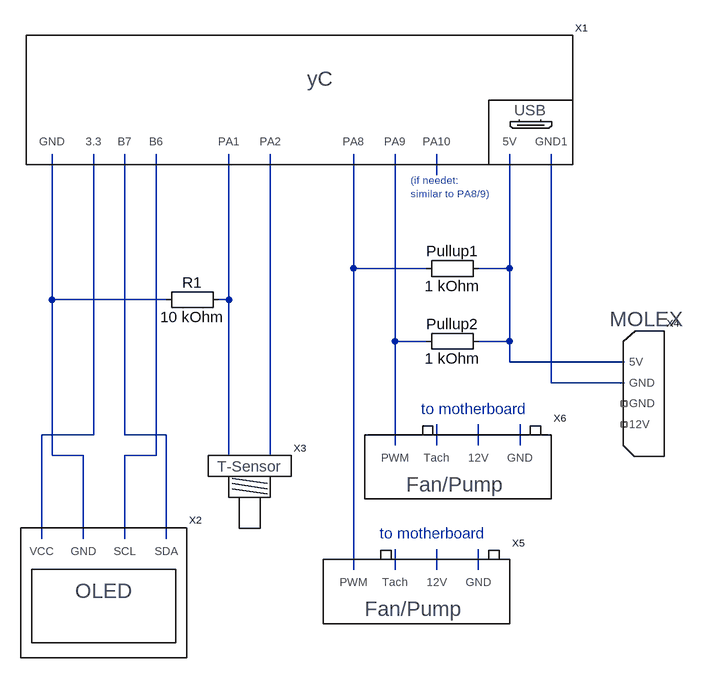
[diagram p0: schematic Circuitry_LTspice.asc]
Circuitry_LTspice.asc, the LTspice schematic file:
Version 4
SHEET 1 1080 1012
WIRE 544 240 544 208
WIRE 416 384 416 208
WIRE 528 384 416 384
WIRE 656 384 656 208
WIRE 656 384 608 384
WIRE -48 432 -48 208
WIRE 128 432 -48 432
WIRE 224 432 224 208
WIRE 224 432 208 432
WIRE 480 496 480 208
WIRE 528 496 480 496
WIRE 656 496 656 384
WIRE 656 496 608 496
WIRE 656 528 656 496
WIRE 832 528 656 528
WIRE 720 560 720 208
WIRE 832 560 720 560
WIRE 16 640 16 208
WIRE 16 640 -64 640
WIRE 64 640 64 208
WIRE 128 640 64 640
WIRE 480 656 480 496
WIRE 544 656 544 624
WIRE 608 656 608 624
WIRE 672 656 672 624
WIRE -48 672 -48 432
WIRE 0 672 -48 672
WIRE 112 672 112 208
WIRE 112 672 64 672
WIRE 224 672 224 432
WIRE 288 672 288 208
WIRE -64 800 -64 640
WIRE 0 800 0 672
WIRE 64 800 64 672
WIRE 128 800 128 640
WIRE 416 848 416 384
WIRE 480 848 480 816
WIRE 544 848 544 816
WIRE 608 848 608 816
SYMBOL yC 224 80 R0
SYMATTR InstName X1
SYMBOL OLED 32 768 R0
SYMATTR InstName X2
SYMBOL tempsens 256 688 R0
SYMATTR InstName X3
SYMBOL MOLEX 832 576 R0
SYMATTR InstName X4
SYMBOL 4Pin_Fan 512 864 R0
SYMATTR InstName X5
SYMBOL 4Pin_Fan 576 672 R0
SYMATTR InstName X6
SYMBOL Misc\\EuropeanResistor 224 416 R90
WINDOW 0 5 56 VBottom 2
WINDOW 3 27 56 VTop 2
SYMATTR InstName R1
SYMATTR Value 10 kOhm
SYMBOL Misc\\EuropeanResistor 624 368 R90
WINDOW 0 5 56 VBottom 2
WINDOW 3 27 56 VTop 2
SYMATTR InstName Pullup1
SYMATTR Value 1 kOhm
SYMBOL Misc\\EuropeanResistor 624 480 R90
WINDOW 0 5 56 VBottom 2
WINDOW 3 27 56 VTop 2
SYMATTR InstName Pullup2
SYMATTR Value 1 kOhm
TEXT 520 600 Left 2 ;to motherboard
TEXT 456 792 Left 2 ;to motherboard
TEXT 504 248 Left 1 ;(if needet: \nsimilar to PA8/9)

The netlist it stands for:
* Circuitry_LTspice.asc
XX1 N004 N008 N009 N013 N005 N014 N002 N006 N001 N003 N007 yC  ; pins GND 3.3 B7 B6 PA1 PA2 PA8 PA9 PA10 5V GND1
XX2 N008 N004 N013 N009 OLED  ; pins VCC GND SCL SDA
XX3 N014 N005 tempsens
XX4 N003 N007 NC_01 NC_02 MOLEX  ; pins 5V GND GND 12V
XX5 N002 N015 N016 N017 4Pin_Fan  ; pins PWM Tach 12V GND
XX6 N006 N010 N011 N012 4Pin_Fan  ; pins PWM Tach 12V GND
R1 N005 N004 10 kOhm
R§Pullup1 N003 N002 1 kOhm
R§Pullup2 N003 N006 1 kOhm
* to motherboard
* to motherboard
* (if needet:
* similar to PA8/9)
.backanno
.end